# Altium project Wi_Drive_V1.5PrjPCB.PrjPCB
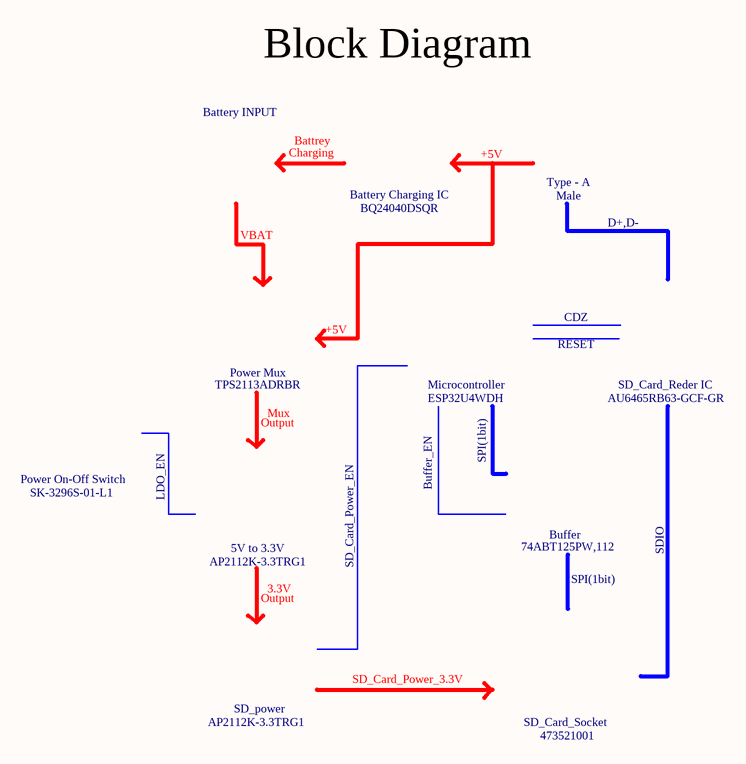
[diagram p0: Block diagram.SchDoc]
3 sheets, 50 parts. Net scope: global (net labels, ports and power ports of the same name join across sheets).
Board files: Wi_Drive_V1.5PcbDoc.PcbDoc, Wi_Drive_V1.5_PanelPcbDoc.PcbDoc
Sheets:
  Block diagram.SchDoc
  Wi_Drive Power.SchDoc
  Microcontroller.SchDoc

## Sheet Block diagram.SchDoc
size 292 x 193 mm; Organization: ORGANIZATION; Address1: ADDRESS 1; Address2: ADDRESS 2; Address3: ADDRESS 3; Address4: ADDRESS 4; Revision: 0.3; SheetNumber: 1; SheetTotal: 3; Project: Maypole; ENG_APP_DATE: --/--/--; DSN_APP_DATE: --/--/--; CHK_APP_DATE: --/--/--; VERSION: 1

### Notes on the sheet
- Block Diagram
- Battery INPUT
- Charging
- Battrey
- Battery Charging IC
- +5V
- Type - A
- Male
- VBAT
- BQ24040DSQR
- D+,D-
- CDZ
- TPS2113ADRBR
- Power Mux
- Microcontroller
- ESP32U4WDH
- RESET
- AU6465RB63-GCF-GR
- SD_Card_Reder IC
- Output
- Mux
- SPI(1bit)
- Power On-Off Switch
- SK-3296S-01-L1
- LDO_EN
- Buffer_EN
- Buffer
- AP2112K-3.3TRG1
- 5V to 3.3V
- 3.3V
- SD_Card_Power_EN
- 74ABT125PW,112
- SDIO
- SD_power
- SD_Card_Power_3.3V
- SD_Card_Socket
- 473521001
- VICHARAK
- TITLE :-
- VERSION :-
- PROJECT :-
- SHEET :-
- OF
- REVISION:-
- DATE :-

## Sheet Wi_Drive Power.SchDoc
size 292 x 193 mm; Revision: 0.3; SheetNumber: 2; SheetTotal: 3; PROJECT: Maypole; VERSION: 1
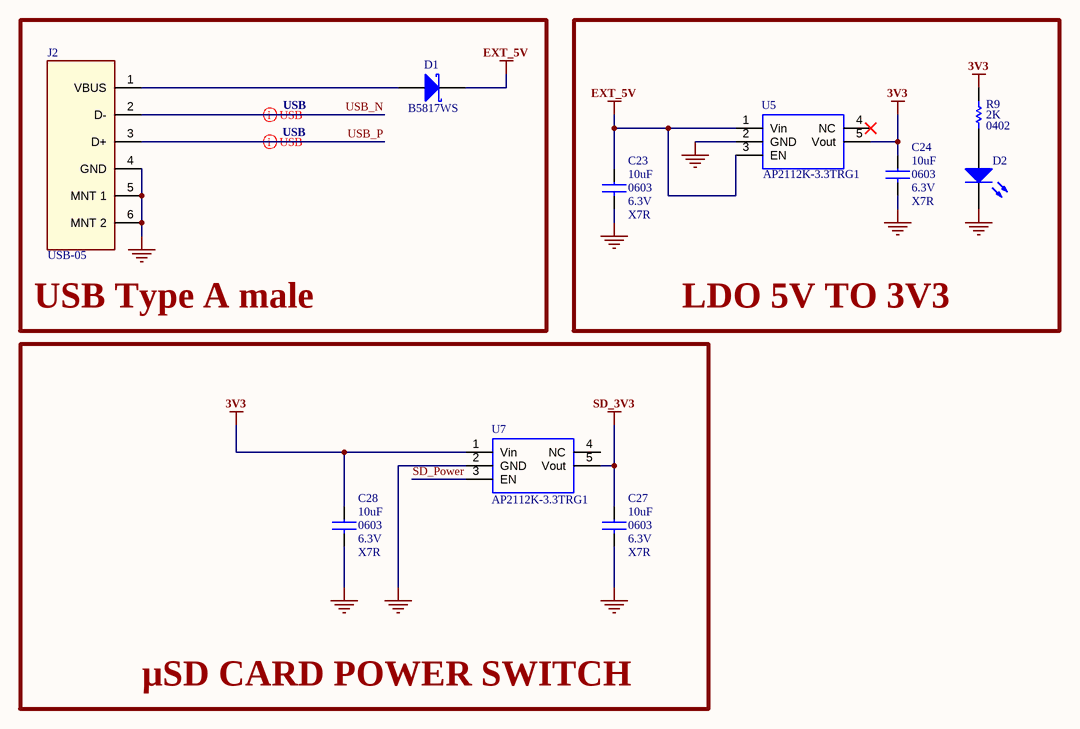
[diagram p1: Wi_Drive Power.SchDoc]

### Parts
C23  value 10uF  Voltage: 6.3V  Dielectric: X7R  Case/Package: 0603  [CAPC0603]
C24  value 10uF  Voltage: 6.3V  Dielectric: X7R  Case/Package: 0603  [CAPC0603]
C27  value 10uF  Voltage: 6.3V  Dielectric: X7R  Case/Package: 0603  [CAPC0603]
C28  value 10uF  Voltage: 6.3V  Dielectric: X7R  Case/Package: 0603  [CAPC0603]
D1  (no value)  [SOD-323]
D2  (no value)  [LED_0603]
J2  Manufacturer Part Number: USB-05  [Molex_48037-0001_0]
R9  value 2K  Case/Package: 0402  [RESC0402]
U5  Manufacturer Part Number: AP2112K-3.3TRG1  [SOT25]
U7  Manufacturer Part Number: AP2112K-3.3TRG1  [SOT25]

### Blocks framed on the sheet
USB Type A male: D1 J2
LDO 5V TO 3V3: C23 C24 D2 R9 U5
μSD CARD POWER SWITCH: C27 C28 U7

### Nets
3V3: C24.1 C28.1 R9.1 U5.5(Vout) U7.1(Vin)
EXT_5V: C23.1 D1.K U5.1(Vin) U5.3(EN)
GND: C23.2 C24.2 C27.2 C28.2 D2.K J2.4(GND) J2.5(MNT_1) J2.6(MNT_2) U5.2(GND) U7.2(GND)
SD_3V3: C27.1 U7.5(Vout)
SD_Power: U7.3(EN)
USB_N: J2.2(D-)
USB_P: J2.3(D+)
NetD1_A: D1.A J2.1(VBUS)
NetD2_A: D2.A R9.2

Not connected (* = marked no-connect by the designer): U5 4(NC)*; U7 4(NC)

### Layout directives
differential pair; net class USB; differential pair class USB: USB_N, USB_P

### Notes on the sheet
- VICHARAK
- TITLE :-
- VERSION :-
- PROJECT :-
- SHEET :-
- OF
- REVISION:-
- DATE :-

### Library data of the parts
C23 C24 C27 C28 = Cap: CAP CER 10uF 6.3V X7R 0603; Manufacturer Part Number: *
D1 = B5817WS: 20V 1A 450mV @ 1A SOD-323 Schottky Barrier Diodes (SBD) RoHS; Manufacturer Part Number: B5817WS; Case/Package: SOD-323
D2 = LED1: LED, RED,SMD, 0603; Case/Package: 0603; Manufacturer Part Number: LED, RED,SMD, 0603
J2 = USB MALE: USB A-type Plug Male PCB R/A; Case/Package: TH
R9 = Resistor: Thick Film Resistor -  2Kohm, 1%, 0402
U5 U7 = LDO_5V_3V: LDO Voltage Regulators 600mA CMOS LDO 50mA 3.3V 250mV; Case/Package: SOT-23-5

## Sheet Microcontroller.SchDoc
size 393 x 281 mm; CompanyName: VICHARAK; Revision: 0.3; SheetNumber: 3; SheetTotal: 3; VERSION: 1; PROJECT: Maypole
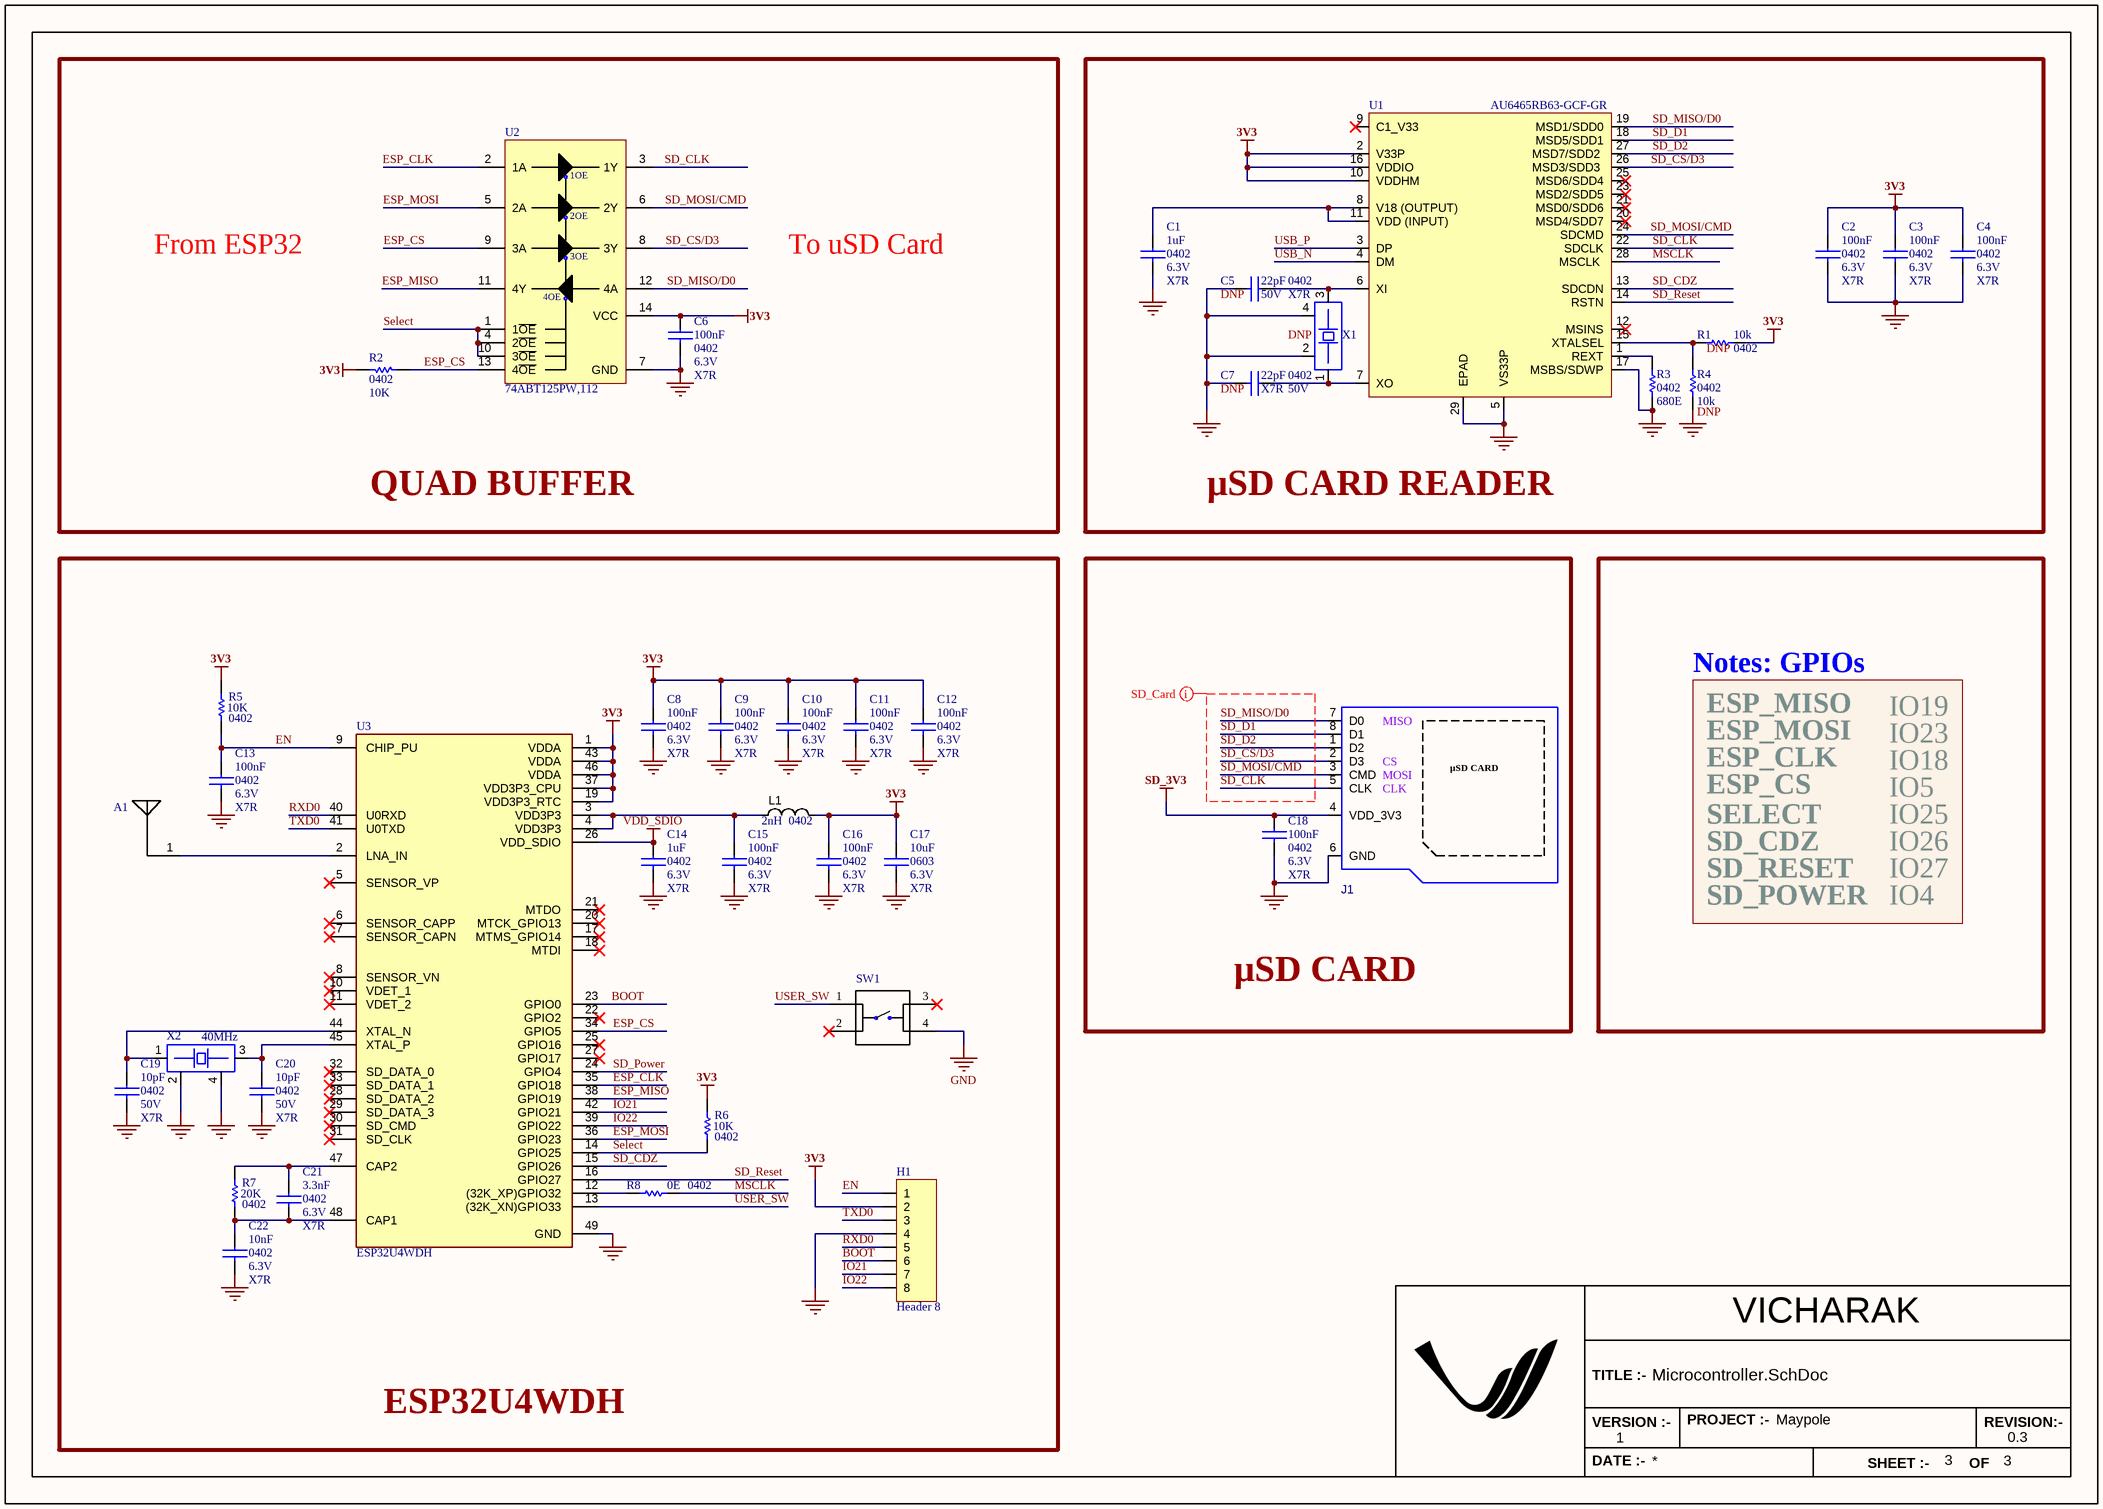
[diagram p2: Microcontroller.SchDoc]

### Parts
A1  Ant  [ANT-SMD_L5.2-W2.1]  (value not drawn)
C1  value 1uF  Voltage: 6.3V  Dielectric: X7R  Case/Package: 0402  [CAPC0402]
C2  value 100nF  Voltage: 6.3V  Dielectric: X7R  Case/Package: 0402  [CAPC0402]
C3  value 100nF  Voltage: 6.3V  Dielectric: X7R  Case/Package: 0402  [CAPC0402]
C4  value 100nF  Voltage: 6.3V  Dielectric: X7R  Case/Package: 0402  [CAPC0402]
C5  value 22pF  Voltage: 50V  Dielectric: X7R  Case/Package: 0402  [CAPC0402]  (no BOM)
C6  value 100nF  Voltage: 6.3V  Dielectric: X7R  Case/Package: 0402  [CAPC0402]
C7  value 22pF  Voltage: 50V  Dielectric: X7R  Case/Package: 0402  [CAPC0402]  (no BOM)
C8  value 100nF  Voltage: 6.3V  Dielectric: X7R  Case/Package: 0402  [CAPC0402]
C9  value 100nF  Voltage: 6.3V  Dielectric: X7R  Case/Package: 0402  [CAPC0402]
C10  value 100nF  Voltage: 6.3V  Dielectric: X7R  Case/Package: 0402  [CAPC0402]
C11  value 100nF  Voltage: 6.3V  Dielectric: X7R  Case/Package: 0402  [CAPC0402]
C12  value 100nF  Voltage: 6.3V  Dielectric: X7R  Case/Package: 0402  [CAPC0402]
C13  value 100nF  Voltage: 6.3V  Dielectric: X7R  Case/Package: 0402  [CAPC0402]
C14  value 1uF  Voltage: 6.3V  Dielectric: X7R  Case/Package: 0402  [CAPC0402]
C15  value 100nF  Voltage: 6.3V  Dielectric: X7R  Case/Package: 0402  [CAPC0402]
C16  value 100nF  Voltage: 6.3V  Dielectric: X7R  Case/Package: 0402  [CAPC0402]
C17  value 10uF  Voltage: 6.3V  Dielectric: X7R  Case/Package: 0603  [CAPC0603]
C18  value 100nF  Voltage: 6.3V  Dielectric: X7R  Case/Package: 0402  [CAPC0402]
C19  value 10pF  Voltage: 50V  Dielectric: X7R  Case/Package: 0402  [CAPC0402]
C20  value 10pF  Voltage: 50V  Dielectric: X7R  Case/Package: 0402  [CAPC0402]
C21  value 3.3nF  Voltage: 6.3V  Dielectric: X7R  Case/Package: 0402  [CAPC0402]
C22  value 10nF  Voltage: 6.3V  Dielectric: X7R  Case/Package: 0402  [CAPC0402]
H1  Header 8  [HEADER_1X08_2.0]
J1  DM3AT-SF-PEJM5(40)  [473521001]  (value not drawn)
L1  Case/Package: 0402  Inductance: 2nH  [IND_0402]
R1  value 10k  Case/Package: 0402  [RESC0402]  (no BOM)
R2  value 10K  Case/Package: 0402  [RESC0402]
R3  value 680E  Case/Package: 0402  [RESC0402]
R4  value 10k  Case/Package: 0402  [RESC0402]  (no BOM)
R5  value 10K  Case/Package: 0402  [RESC0402]
R6  value 10K  Case/Package: 0402  [RESC0402]
R7  value 20K  Case/Package: 0402  [RESC0402]
R8  value 0E  Case/Package: 0402  [RESC0402]
SW1  Button  [RIGHT ANGLE PUSH BUTTON SMD]  (value not drawn)
U1  (no value)  [AU6465RB63-GCF-GR]
U2  Manufacturer Part Number: 74ABT125PW,112  [74ABT125PW]
U3  Manufacturer Part Number: ESP32U4WDH  [QFN48_5X5]
X1  (no value)  [CRYSTAL_3225]  (no BOM)
X2  Frequency: 40MHz  [Crystal_3225]

### Blocks framed on the sheet
QUAD BUFFER: C6 R2 U2
μSD CARD READER: C1-C5 C7 R1 R3 R4 U1 X1
ESP32U4WDH: A1 C8-C17 C19-C22 H1 L1 R5-R8 SW1 U3 X2
μSD CARD: C18 J1

### Nets
3V3: C2.1 C3.1 C4.1 C6.1 C8.1 C9.1 C10.1 C11.1 C12.1 C16.1 C17.1 H1.2 L1.1 R1.2 R2.1 R5.1 R6.1 U1.2(V33P) U1.10(VDDHM) U1.16(VDDIO) U2.14(VCC) U3.1(VDDA) U3.19(VDD3P3_RTC) U3.37(VDD3P3_CPU) U3.43(VDDA) U3.46(VDDA)
GND: C1.2 C2.2 C3.2 C4.2 C5.2 C6.2 C7.2 C8.2 C9.2 C10.2 C11.2 C12.2 C13.2 C14.2 C15.2 C16.2 C17.2 C18.2 C19.2 C20.2 C22.2 H1.4 J1.6(GND) R3.2 R4.2 SW1.4 U1.5(VS33P) U1.17(MSBS/SDWP) U1.29(EPAD) U2.7(GND) U3.49(GND) X1.2 X1.4 X2.2 X2.4
SD_3V3: C18.1 J1.4(VDD_3V3)
VDD_SDIO: C14.1 U3.26(VDD_SDIO)
BOOT: H1.6 U3.23(GPIO0)
EN: C13.1 H1.1 R5.2 U3.9(CHIP_PU)
ESP_CLK: U2.2(1A) U3.35(GPIO18)
ESP_CS: R2.2 U2.9(3A) U2.13(4~{OE}) U3.34(GPIO5)
ESP_MISO: U2.11(4Y) U3.38(GPIO19)
ESP_MOSI: U2.5(2A) U3.36(GPIO23)
IO21: H1.7 U3.42(GPIO21)
IO22: H1.8 U3.39(GPIO22)
MSCLK: R8.1 U1.28(MSCLK)
RXD0: H1.5 U3.40(U0RXD)
SD_CDZ: U1.13(SDCDN) U3.15(GPIO26)
SD_CLK: J1.5(CLK) U1.22(SDCLK) U2.3(1Y)
SD_CS/D3: J1.2(D3) U1.26(MSD3/SDD3) U2.8(3Y)
SD_D1: J1.8(D1) U1.18(MSD5/SDD1)
SD_D2: J1.1(D2) U1.27(MSD7/SDD2)
SD_MISO/D0: J1.7(D0) U1.19(MSD1/SDD0) U2.12(4A)
SD_MOSI/CMD: J1.3(CMD) U1.24(SDCMD) U2.6(2Y)
SD_Power: U3.24(GPIO4)
SD_Reset: U1.14(RSTN) U3.16(GPIO27)
Select: R6.2 U2.1(1~{OE}) U2.4(2~{OE}) U2.10(3~{OE}) U3.14(GPIO25)
TXD0: H1.3 U3.41(U0TXD)
USB_N: U1.4(DM)
USB_P: U1.3(DP)
USER_SW: SW1.1 U3.13((32K_XN)GPIO33)
NetA1_1: A1.1(Ant) U3.2(LNA_IN)
NetC1_1: C1.1 U1.8(V18_(OUTPUT)) U1.11(VDD_(INPUT))
NetC5_1: C5.1 U1.6(XI) X1.3
NetC7_1: C7.1 U1.7(XO) X1.1
NetC15_1: C15.1 L1.2 U3.3(VDD3P3) U3.4(VDD3P3)
NetC19_1: C19.1 U3.44(XTAL_N) X2.1
NetC20_1: C20.1 U3.45(XTAL_P) X2.3
NetC21_1: C21.1 R7.1 U3.47(CAP2)
NetC21_2: C21.2 C22.1 R7.2 U3.48(CAP1)
NetR1_1: R1.1 R4.1 U1.15(XTALSEL)
NetR3_1: R3.1 U1.1(REXT)
NetR8_2: R8.2 U3.12((32K_XP)GPIO32)

Not connected (* = marked no-connect by the designer): SW1 2* 3*; U1 9(C1_V33)* 12(MSINS)* 20(MSD4/SDD7)* 21(MSD0/SDD6)* 23(MSD2/SDD5)* 25(MSD6/SDD4)*; U3 5(SENSOR_VP)* 6(SENSOR_CAPP)* 7(SENSOR_CAPN)* 8(SENSOR_VN)* 10(VDET_1)* 11(VDET_2)* 17(MTMS_GPIO14)* 18(MTDI)* 20(MTCK_GPIO13)* 21(MTDO)* 22(GPIO2)* 25(GPIO16)* 27(GPIO17)* 28(SD_DATA_2)* 29(SD_DATA_3)* 30(SD_CMD)* 31(SD_CLK)* 32(SD_DATA_0)* 33(SD_DATA_1)*

### Layout directives
net class SD_Card: SD_CLK, SD_CS/D3, SD_D1, SD_D2, SD_MISO/D0, SD_MOSI/CMD

### Notes on the sheet
- From ESP32
- To uSD Card
- (near C5) DNP
- (near X1) DNP
- (near R1) DNP
- (near C7) DNP
- (near R4) DNP
- Notes: GPIOs
- ESP_MISO
- IO19
- ESP_MOSI
- ESP_CLK
- IO23
- IO18
- ESP_CS
- SELECT
- SD_CDZ
- IO5
- IO25
- IO26
- SD_RESET
- SD_POWER
- IO27
- IO4
- VICHARAK
- TITLE :-
- VERSION :-
- PROJECT :-
- SHEET :-
- OF
- REVISION:-
- DATE :-
- (in symbol 74ABT125PW_112) 1OE; 2OE; 3OE; 4OE
- (in symbol DM3AT-SF-PEJM5(40)) MISO; CS; MOSI; μSD CARD

### Library data of the parts
A1 = Ant: SMD,2.1x5.2mm Antennas ROHS; Manufacturer Part Number: SLDA52-2R710G-S1TF; Case/Package: SMD
C1 C14 = Cap: CAP CER 1uF 6.3V X7R 0402; Manufacturer Part Number: *
C2-C4 C6 C8-C13 C15 C16 C18 = Cap: CAP CER 100nF 6.3V X7R 0402; Manufacturer Part Number: *
C5 C7 = Cap: CAP CER 22pF 50V X7R 0402; Manufacturer Part Number: *; DNP: DNP
C17 = Cap: CAP CER 10uF 6.3V X7R 0603; Manufacturer Part Number: *
C19 C20 = Cap: CAP CER 10pF 50V X7R 0402; Manufacturer Part Number: *
C21 = Cap: CAP CER 3.3nF 6.3V X7R 0402; Manufacturer Part Number: *
C22 = Cap: CAP CER 10nF 6.3V X7R 0402; Manufacturer Part Number: *
H1 = Header 8: Header, 08-Pin,2mm; Manufacturer Part Number: 1.27mm PITCH; LatestRevisionDate: 17-Jul-2002; Case/Package: TH
J1 = DM3AT-SF-PEJM5(40): Micro SD Memory Card Socket; Case/Package: SMD
L1 = Inductor: 2nH ±0.3nH 900mA 120mΩ 0402 Inductors (SMD) RoHS; Manufacturer 1: Murata; Manufacturer Part Number: LQG15HN2N0S02D; Description 1: Fixed Inductors 0402 2.0nH; Category 1: Fixed Inductors; Core Material: Air; DC Resistance (DCR): 120mR; Q Factor: 8; Shielding: Unshielded; Self Resonant Frequency: 6GHz; Test Frequency: 100MHz; Supplier 1: LCSC; Supplier Part Number 1: C97984; RoHS 1: Yes; Stock 1: 84500; Pricing 1: 50=0.00840, 500=0.00620, 1500=0.00580, 5000=0.00540, 25000=0.00520, 50000=0.00520, 50=0.00810, 500=0.00600, 1500=0.00560, 5000=0.00520, 25000=0.00500, 50000=0.00500, 50=0.04180, 500=0.03090, 1500=0.02890, 5000=0.02690, 25000=0.02600, 50000=0.02550, 50=0.03860, 500=0.02850, 1500=0.02670, 5000=0.02480, 25000=0.02400, 50000=0.02360, 50=0.00520, 500=0.00380, 1500=0.00360, 5000=0.00330, 25000=0.00320, 50000=0.00320, 50=0.00480, 500=0.00350, 1500=0.00330, 5000=0.00310, 25000=0.00300, 50000=0.00290, 50=0.04770, 500=0.03530, 1500=0.03300, 5000=0.03070, 25000=0.02970, 50000=0.02920, 50=0.65070, 500=0.48080, 1500=0.44960, 5000=0.41830, 25000=0.40450, 50000=0.39760, 50=0.02550, 500=0.01880, 1500=0.01760, 5000=0.01640, 25000=0.01580, 50000=0.01560, 50=0.46320, 500=0.34230, 1500=0.32010, 5000=0.29780, 25000=0.28800, 50000=0.28310, 50=0.05400, 500=0.03990, 1500=0.03730, 5000=0.03470, 25000=0.03360, 50000=0.03300, 50=0.00840, 500=0.00620, 1500=0.00580, 5000=0.00540, 25000=0.00520, 50000=0.00510, 50=0.00616, 500=0.00455, 1500=0.00426, 5000=0.00396, 25000=0.00383, 50000=0.00376 (AUD); Mount: Surface Mount; Number of Pins: 2; Case Code (Metric): 1005; Case Code (Imperial): 0402; Min Operating Temperature: -55°C; Max Operating Temperature: 125°C; Max DC Current: 900mA; Package Quantity: 10000; Current Rating: 900mA; Packaging: Tape and Reel; Current: 900mA; Termination: SMD/SMT; DC Current: 900mA; Length: 1mm; Height: 0.5mm; Width: 0.02inch; Height - Seated (Max): 0.022inch; Depth: 0.55mm; Radiation Hardening: No; REACH SVHC: No SVHC; Military Standard: Not; ComponentLink1URL: https://datasheet.ciiva.com/11799/0900766b8090d3b8-11799042.pdf?src-supplier=RSComponents; ComponentLink1Description: https://datasheet.ciiva.com/11799/0900766b8090d3b8-11799042.pdf?src-supplier=RSComponents; ComponentLink2URL: https://datasheet.ciiva.com/4976/o05e-4976477.pdf?src-supplier=Mouser; ComponentLink2Description: https://datasheet.ciiva.com/4976/o05e-4976477.pdf?src-supplier=Mouser; ComponentLink3URL: https://datasheet.ciiva.com/8510/l0075s0083lqg15hn-8510907.pdf?src-supplier=Avnet; ComponentLink3Description: https://datasheet.ciiva.com/8510/l0075s0083lqg15hn-8510907.pdf?src-supplier=Avnet; ComponentLink4URL: https://datasheet.ciiva.com/17279/l0075s0083lqg15hn-17279196.pdf?src-supplier=Avnet+Europe; ComponentLink4Description: https://datasheet.ciiva.com/17279/l0075s0083lqg15hn-17279196.pdf?src-supplier=Avnet+Europe
R1 R4 = Resistor: Thick Film Resistor -  10kohm, 1%, 0402; DNP: DNP
R2 R5 R6 = Resistor: Thick Film Resistor -  10Kohm, 1%, 0402
R3 = Resistor: Thick Film Resistor -  680ohm, 1%, 0402
R7 = Resistor: Thick Film Resistor -  20Kohm, 1%, 0402
R8 = Resistor: Thick Film Resistor -  0ohm, 1%, 0402
SW1 = Button: 6mm 5mm Round Button 50mA Straight 6mm SPST 12V Plugin Tactile Switches ROHS; Manufacturer Part Number: TS-1809SM-C; Case/Package: SMD; Value: *
U1 = AU6465RB63-GCF-GR: Controller QFN-28-EP(5x5) USB ICs ROHS; Case/Package: QFN-28-EP(5x5); Manufacturer Part Number: AU6465RB63-GCF-GR
U2 = 74ABT125PW_112: Buffers & Line Drivers QUAD BUFFER 3-S; Manufacturer_Name: Nexperia; Case/Package: 14-TSSOP
U3 = ESP32-D0WD: MCU Bluetooth, WiFi - 2.4GHz 48-QFN; Manufacturer: Espressif Systems; Case/Package: 48-QFN
X1 = CRYSTAL (7M-25.000MEEQ-T): 12MHz ±25ppm Crystal 12pF 120 Ohms 4-SMD, No Lead; Manufacturer Part Number: ECS-120-20-33-TR; Case/Package: SMD/SMT; ComponentLink1URL: https://www.verical.com/server-webapp/html/getDatasheet?partID=757227&src-supplier=Verical; ComponentLink1Description: https://www.verical.com/server-webapp/html/getDatasheet?partID=757227&src-supplier=Verical; ComponentLink2URL: http://www.txccrystal.com/images/pdf/7m-accuracy.pdf?src-supplier=Digi-Key; ComponentLink2Description: http://www.txccrystal.com/images/pdf/7m-accuracy.pdf?src-supplier=Digi-Key; ComponentLink3URL: http://www.farnell.com/datasheets/1794111.pdf?src-supplier=Element14; ComponentLink3Description: http://www.farnell.com/datasheets/1794111.pdf?src-supplier=Element14; ComponentLink4URL: http://www.mouser.com/ds/2/417/7m-11184.pdf?src-supplier=Mouser; ComponentLink4Description: http://www.mouser.com/ds/2/417/7m-11184.pdf?src-supplier=Mouser; DNP: DNP
X2 = CRYSTAL_1_1: 40MHz ±10ppm 10pF 30Ω SMD-3225 SMD Crystal Resonators RoHS; Manufacturer Part Number: 7M40000049; Case/Package: SMD-3225

## Nets that join several sheets
3V3: Wi_Drive Power (5 pins), Microcontroller (26 pins)
GND: Wi_Drive Power (10 pins), Microcontroller (35 pins)
SD_3V3: Wi_Drive Power (C27.1 U7.5), Microcontroller (C18.1 J1.4)
SD_Power: Wi_Drive Power (U7.3), Microcontroller (U3.24)
USB_N: Wi_Drive Power (J2.2), Microcontroller (U1.4)
USB_P: Wi_Drive Power (J2.3), Microcontroller (U1.3)